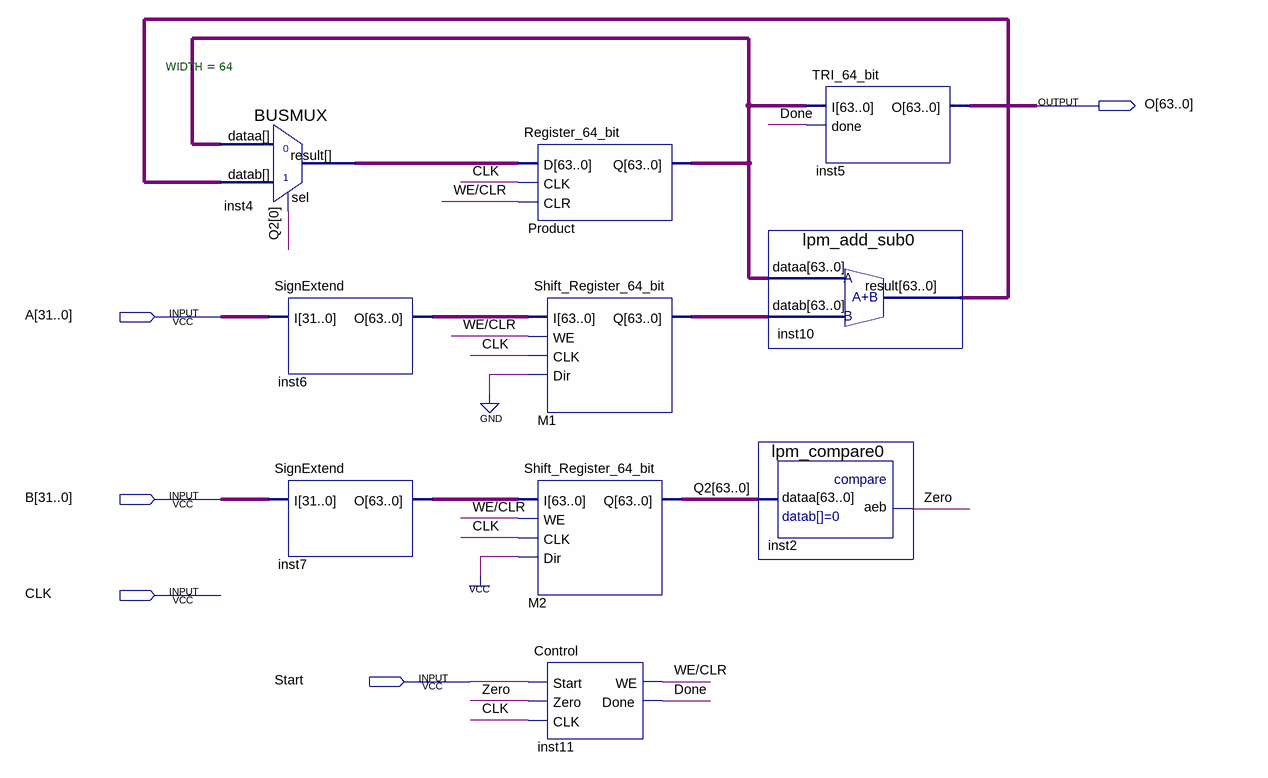
[diagram p0: schematic sheet]
// Quartus schematic Bo_Nhan_64_Bit.bdf as structural Verilog: 10 symbols, 5 pins
module Bo_Nhan_64_Bit (
  input  [31:0] A,
  input  [31:0] B,
  input  CLK,
  input  Start,
  output [63:0] O
);

  wire Done, \WE/CLR , Zero;
  wire [63:0] inst4_result, inst6_o, inst7_o, inst10_result, M1_q, Product_q, Q2;

  BUSMUX #(.WIDTH(64)) inst4 (.datab(inst10_result), .sel(Q2[0]), .dataa(Product_q), .result(inst4_result));
  SignExtend inst6 (.I(A), .O(inst6_o));
  SignExtend inst7 (.I(B), .O(inst7_o));
  Register_64_bit Product (.D(inst4_result), .CLK(CLK), .CLR(\WE/CLR ), .Q(Product_q));
  Shift_Register_64_bit M2 (.I(inst7_o), .WE(\WE/CLR ), .CLK(CLK), .Dir(1'b1), .Q(Q2));
  Shift_Register_64_bit M1 (.I(inst6_o), .WE(\WE/CLR ), .CLK(CLK), .Dir(1'b0), .Q(M1_q));
  Control inst11 (.Start(Start), .Zero(Zero), .CLK(CLK), .WE(\WE/CLR ), .Done(Done));
  TRI_64_bit inst5 (.I(Product_q), .done(Done), .O(O));
  lpm_add_sub0 inst10 (.dataa(Product_q), .datab(M1_q), .result(inst10_result));
  lpm_compare0 inst2 (.dataa(Q2), .aeb(Zero));
endmodule
